# Altium schematic sheet aucma_tranfer.SchDoc
size A3
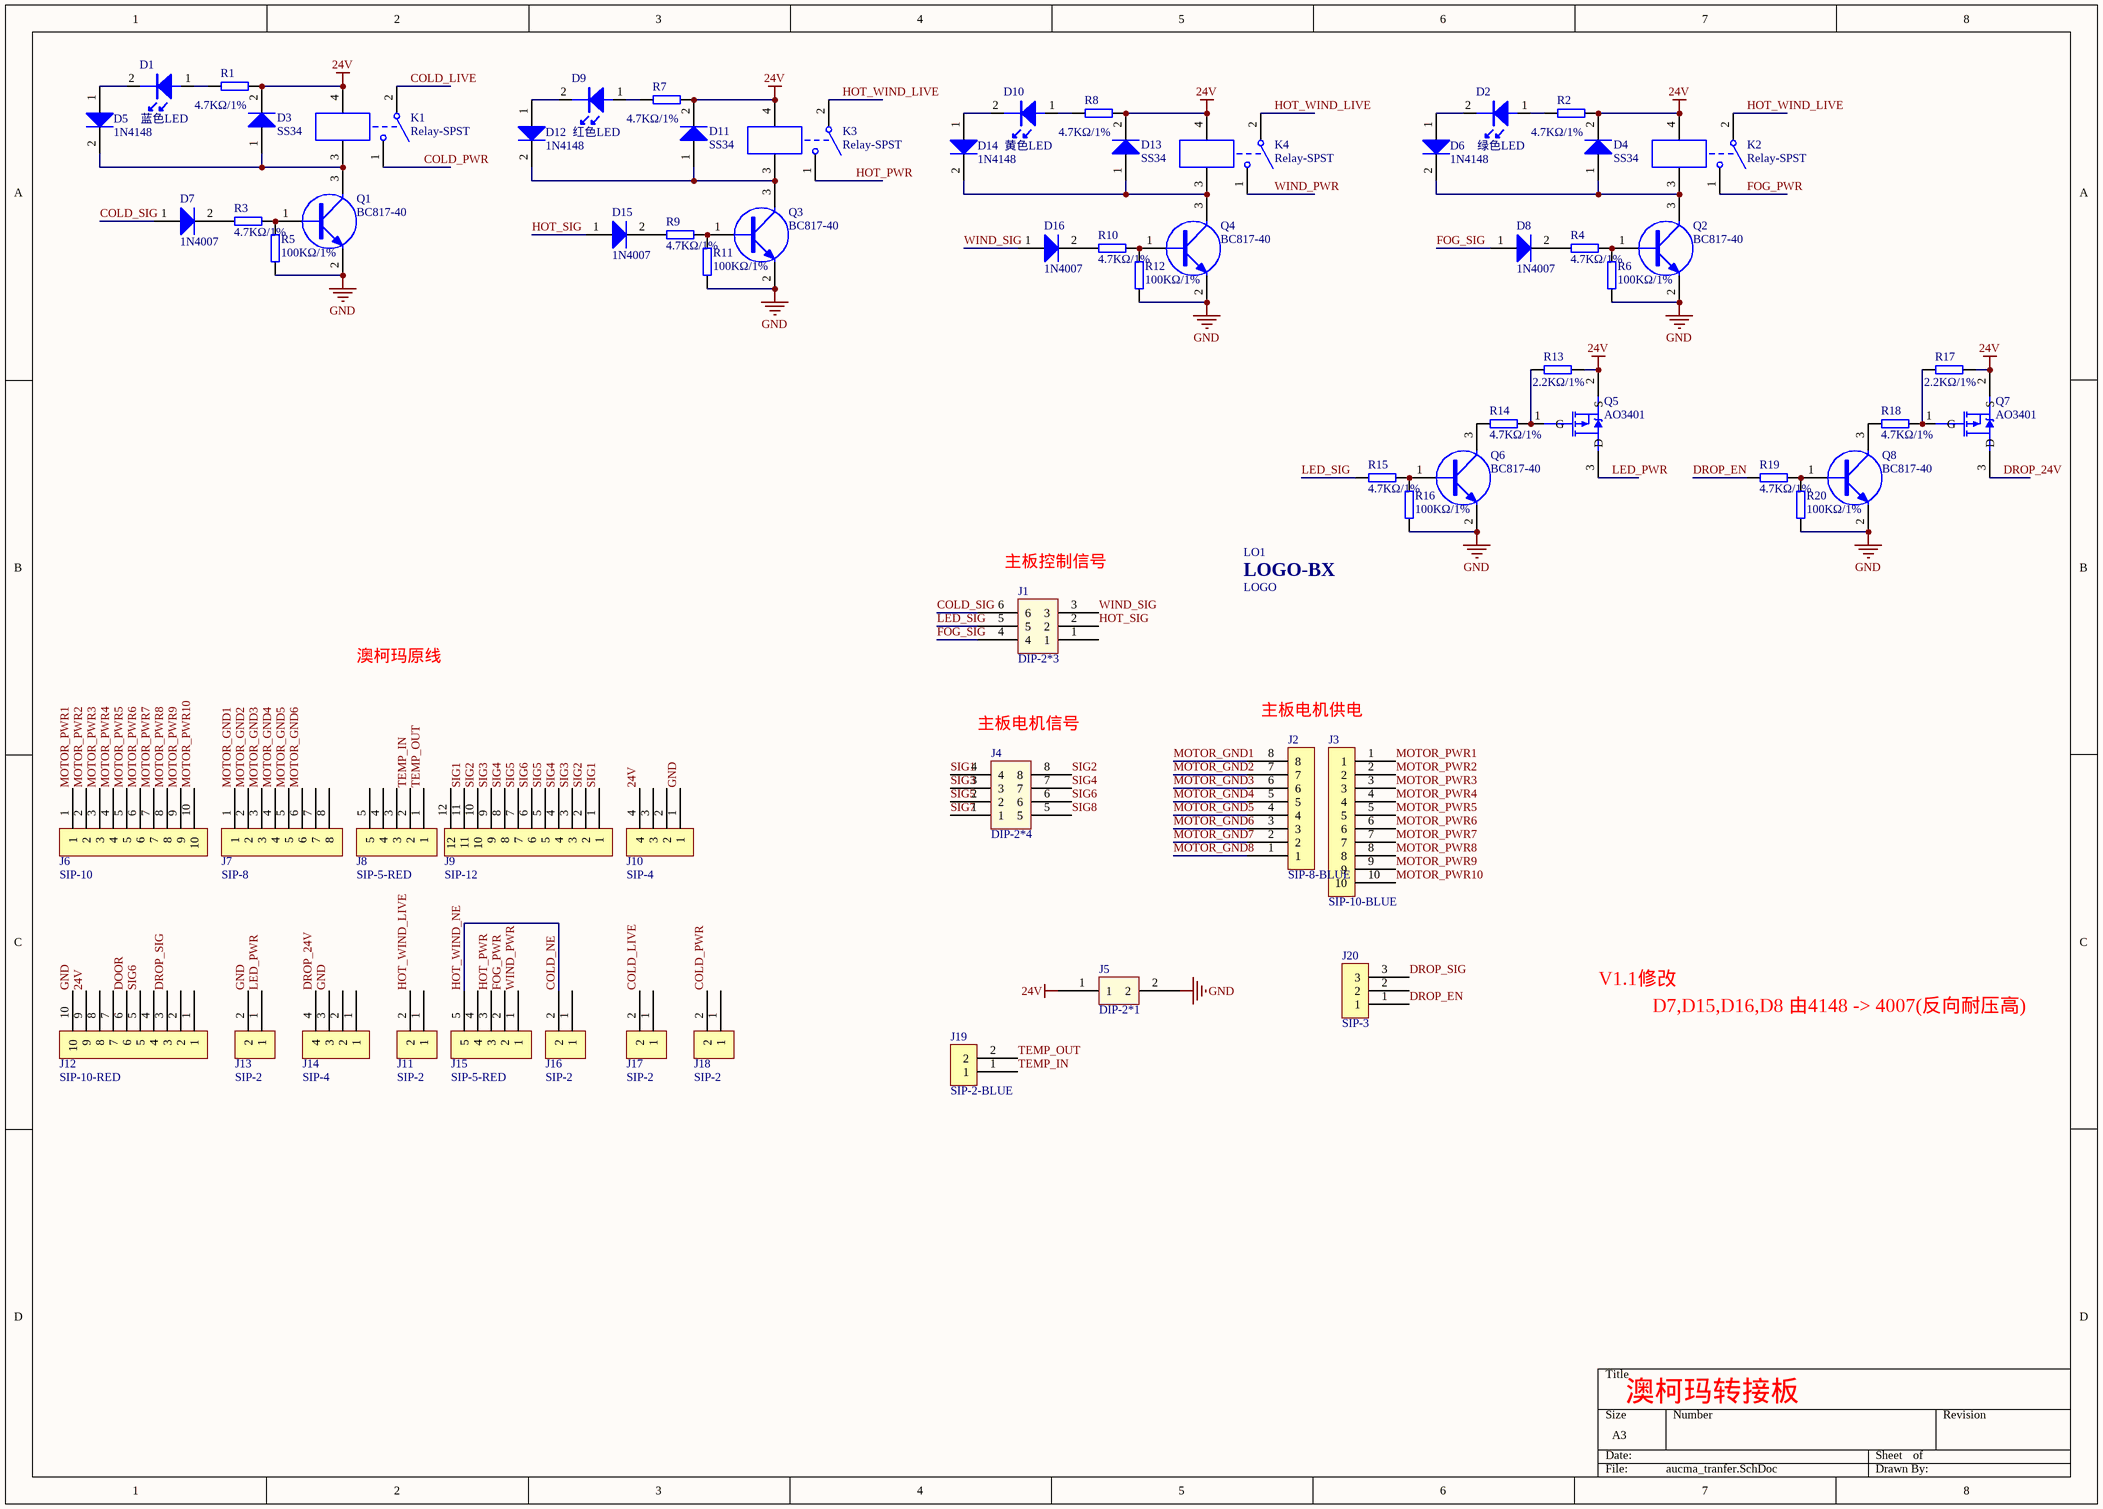
[diagram p0: aucma_tranfer.SchDoc]

## Parts
D1  蓝色LED  [0603_D]
D2  绿色LED  [0603_D]
D3  SS34  [SMA/DO214AC]
D4  SS34  [SMA/DO214AC]
D5  1N4148  [LL34_2P]
D6  1N4148  [LL34_2P]
D7  1N4007  [SMA/DO214AC]
D8  1N4007  [SMA/DO214AC]
D9  红色LED  [0603_D]
D10  黄色LED  [0603_D]
D11  SS34  [SMA/DO214AC]
D12  1N4148  [LL34_2P]
D13  SS34  [SMA/DO214AC]
D14  1N4148  [LL34_2P]
D15  1N4007  [SMA/DO214AC]
D16  1N4007  [SMA/DO214AC]
J1  DIP-2*3  [小5557-2*3A]
J2  SIP-8-BLUE  [XHB-8A]
J3  SIP-10-BLUE  [XHB-10A]
J4  DIP-2*4  [PHB-2*4A]
J5  DIP-2*1  [5557-2*1A]
J6  SIP-10  [XHB-10A]
J7  SIP-8  [XHB-8A]
J8  SIP-5-RED  [XHB-5A]
J9  SIP-12  [XHB-12A]
J10  SIP-4  [VH3.96-4A]
J11  SIP-2  [positioning crimp terminals]
J12  SIP-10-RED  [XHB-10A]
J13  SIP-2  [VH3.96-2A]
J14  SIP-4  [XHB-4A]
J15  SIP-5-RED  [VH3.96-5A]
J16  SIP-2  [positioning crimp terminals]
J17  SIP-2  [positioning crimp terminals]
J18  SIP-2  [positioning crimp terminals]
J19  SIP-2-BLUE  [XHB-2A]
J20  SIP-3  [XHB-3A]
K1  Relay-SPST  [SLA-24VDC-SL-A]
K2  Relay-SPST  [HF152FD-1H]
K3  Relay-SPST  [HF152FD-1H]
K4  Relay-SPST  [HF152FD-1H]
LO1  LOGO  [THAND]
Q1  BC817-40  [SOT-23-3]
Q2  BC817-40  [SOT-23-3]
Q3  BC817-40  [SOT-23-3]
Q4  BC817-40  [SOT-23-3]
Q5  AO3401  [SOT-23-3]
Q6  BC817-40  [SOT-23-3]
Q7  AO3401  [SOT-23-3]
Q8  BC817-40  [SOT-23-3]
R1  4.7KΩ/1%  [0805_R]
R2  4.7KΩ/1%  [0805_R]
R3  4.7KΩ/1%  [0603_R]
R4  4.7KΩ/1%  [0603_R]
R5  100KΩ/1%  [0603_R]
R6  100KΩ/1%  [0603_R]
R7  4.7KΩ/1%  [0805_R]
R8  4.7KΩ/1%  [0805_R]
R9  4.7KΩ/1%  [0603_R]
R10  4.7KΩ/1%  [0603_R]
R11  100KΩ/1%  [0603_R]
R12  100KΩ/1%  [0603_R]
R13  2.2KΩ/1%  [0603_R]
R14  4.7KΩ/1%  [0603_R]
R15  4.7KΩ/1%  [0603_R]
R16  100KΩ/1%  [0603_R]
R17  2.2KΩ/1%  [0603_R]
R18  4.7KΩ/1%  [0603_R]
R19  4.7KΩ/1%  [0603_R]
R20  100KΩ/1%  [0603_R]

## Nets
24V: D3.2(K) D4.2(K) D11.2(K) D13.2(K) J5.1 J10.4 J12.9 K1.4 K2.4 K3.4 K4.4 Q5.2(S) Q7.2(S) R1.2 R2.2 R7.2 R8.2 R13.1 R17.1
GND: J5.2 J10.1 J12.10 J13.2 J14.3 Q1.2 Q2.2 Q3.2 Q4.2 Q6.2 Q8.2 R5.1 R6.1 R11.1 R12.1 R16.1 R20.1
COLD_LIVE: J17.2 K1.2
COLD_NE: J15.5 J16.2  [also labelled HOT_WIND_NE]
COLD_PWR: J18.2 K1.1
COLD_SIG: D7.1(A) J1.6
DOOR: J12.6
DROP_24V: J14.4 Q7.3(D)
DROP_EN: J20.1 R19.1
DROP_SIG: J12.3 J20.3
FOG_PWR: J15.2 K2.1
FOG_SIG: D8.1(A) J1.4
HOT_PWR: J15.3 K3.1
HOT_SIG: D15.1(A) J1.2
HOT_WIND_LIVE: J11.2 K2.2 K3.2 K4.2
LED_PWR: J13.1 Q5.3(D)
LED_SIG: J1.5 R15.1
MOTOR_GND1: J2.8 J7.1
MOTOR_GND2: J2.7 J7.2
MOTOR_GND3: J2.6 J7.3
MOTOR_GND4: J2.5 J7.4
MOTOR_GND5: J2.4 J7.5
MOTOR_GND6: J2.3 J7.6
MOTOR_GND7: J2.2
MOTOR_GND8: J2.1
MOTOR_PWR1: J3.1 J6.1
MOTOR_PWR2: J3.2 J6.2
MOTOR_PWR3: J3.3 J6.3
MOTOR_PWR4: J3.4 J6.4
MOTOR_PWR5: J3.5 J6.5
MOTOR_PWR6: J3.6 J6.6
MOTOR_PWR7: J3.7 J6.7
MOTOR_PWR8: J3.8 J6.8
MOTOR_PWR9: J3.9 J6.9
MOTOR_PWR10: J3.10 J6.10
SIG1: J4.4 J9.1 J9.11
SIG2: J4.8 J9.2 J9.10
SIG3: J4.3 J9.3 J9.9
SIG4: J4.7 J9.4 J9.8
SIG5: J4.2 J9.5 J9.7
SIG6: J4.6 J9.6 J12.5
SIG7: J4.1
SIG8: J4.5
TEMP_IN: J8.2 J19.1
TEMP_OUT: J8.1 J19.2
WIND_PWR: J15.1 K4.1
WIND_SIG: D16.1(A) J1.3
NetD1_1: D1.1 R1.1
NetD1_2: D1.2 D5.1(A)
NetD2_1: D2.1 R2.1
NetD2_2: D2.2 D6.1(A)
NetD3_1: D3.1(A) D5.2(K) K1.3 Q1.3
NetD4_1: D4.1(A) D6.2(K) K2.3 Q2.3
NetD7_2: D7.2(K) R3.1
NetD8_2: D8.2(K) R4.1
NetD9_1: D9.1 R7.1
NetD9_2: D9.2 D12.1(A)
NetD10_1: D10.1 R8.1
NetD10_2: D10.2 D14.1(A)
NetD11_1: D11.1(A) D12.2(K) K3.3 Q3.3
NetD13_1: D13.1(A) D14.2(K) K4.3 Q4.3
NetD15_2: D15.2(K) R9.1
NetD16_2: D16.2(K) R10.1
NetQ1_1: Q1.1 R3.2 R5.2
NetQ2_1: Q2.1 R4.2 R6.2
NetQ3_1: Q3.1 R9.2 R11.2
NetQ4_1: Q4.1 R10.2 R12.2
NetQ5_1: Q5.1(G) R13.2 R14.2
NetQ6_1: Q6.1 R15.2 R16.2
NetQ6_3: Q6.3 R14.1
NetQ7_1: Q7.1(G) R17.2 R18.2
NetQ8_1: Q8.1 R19.2 R20.2
NetQ8_3: Q8.3 R18.1

Not connected (* = marked no-connect by the designer): J1 1; J7 7 8; J8 3 4 5; J9 12; J10 2 3; J11 1; J12 1 2 4 7 8; J14 1 2; J15 4; J16 1; J17 1; J18 1; J20 2

## Notes on the sheet
- (near J1) 主板控制信号
- 澳柯玛原线
- 主板电机供电
- (near J4) 主板电机信号
- V1.1修改
- D7,D15,D16,D8 由4148 -> 4007(反向耐压高)
- 澳柯玛转接板
- (in symbol LOGO) LOGO-BX

## Library data of the parts
D1 D2 D9 D10 = LED: 发光二极管
D3-D8 D11-D16 = Diodes: 二极管
J1 = DIP-2*3: 双排2*3P插座
J2 J7 = SIP-8: 单排8P插座
J3 J6 J12 = SIP-10: 单排10P插座
J4 = DIP-2*4: 双排2*4P插座
J5 = DIP-2*1: 双排2*1P插座
J8 J15 = SIP-5: 单排5P插座
J9 = SIP-12: 单排12P插座
J10 J14 = SIP-4: 单排4P插座
J11 J13 J16-J19 = SIP-2: 单排2P插座
J20 = SIP-3: 单排3P插座
K1-K4 = Relay-SPST: 继电器 1组常开(单刀单掷); Published: 24-Mar-1999; LatestRevisionDate: 17-Jul-2002; LatestRevisionNote: Re-released for DXP Platform.; PackageReference: MODULE5B; Publisher: Altium Limited
LO1 = LOGO: 百兴Logo
Q1-Q4 Q6 Q8 = NPN: 三极管
Q5 Q7 = MOSFET_P: P-Channel MOSFET; PackageDocument: 1995/1996; Published: 8-Jun-2000; LatestRevisionDate: 17-Jul-2002; LatestRevisionNote: Re-released for DXP Platform.; PackageReference: E3; Publisher: Altium Limited
R1-R20 = RES2: 电阻